# Altium schematic sheet Power_Amplifier.SchDoc
size A4; DocumentNumber: 11; SheetNumber: 11; SheetTotal: 11
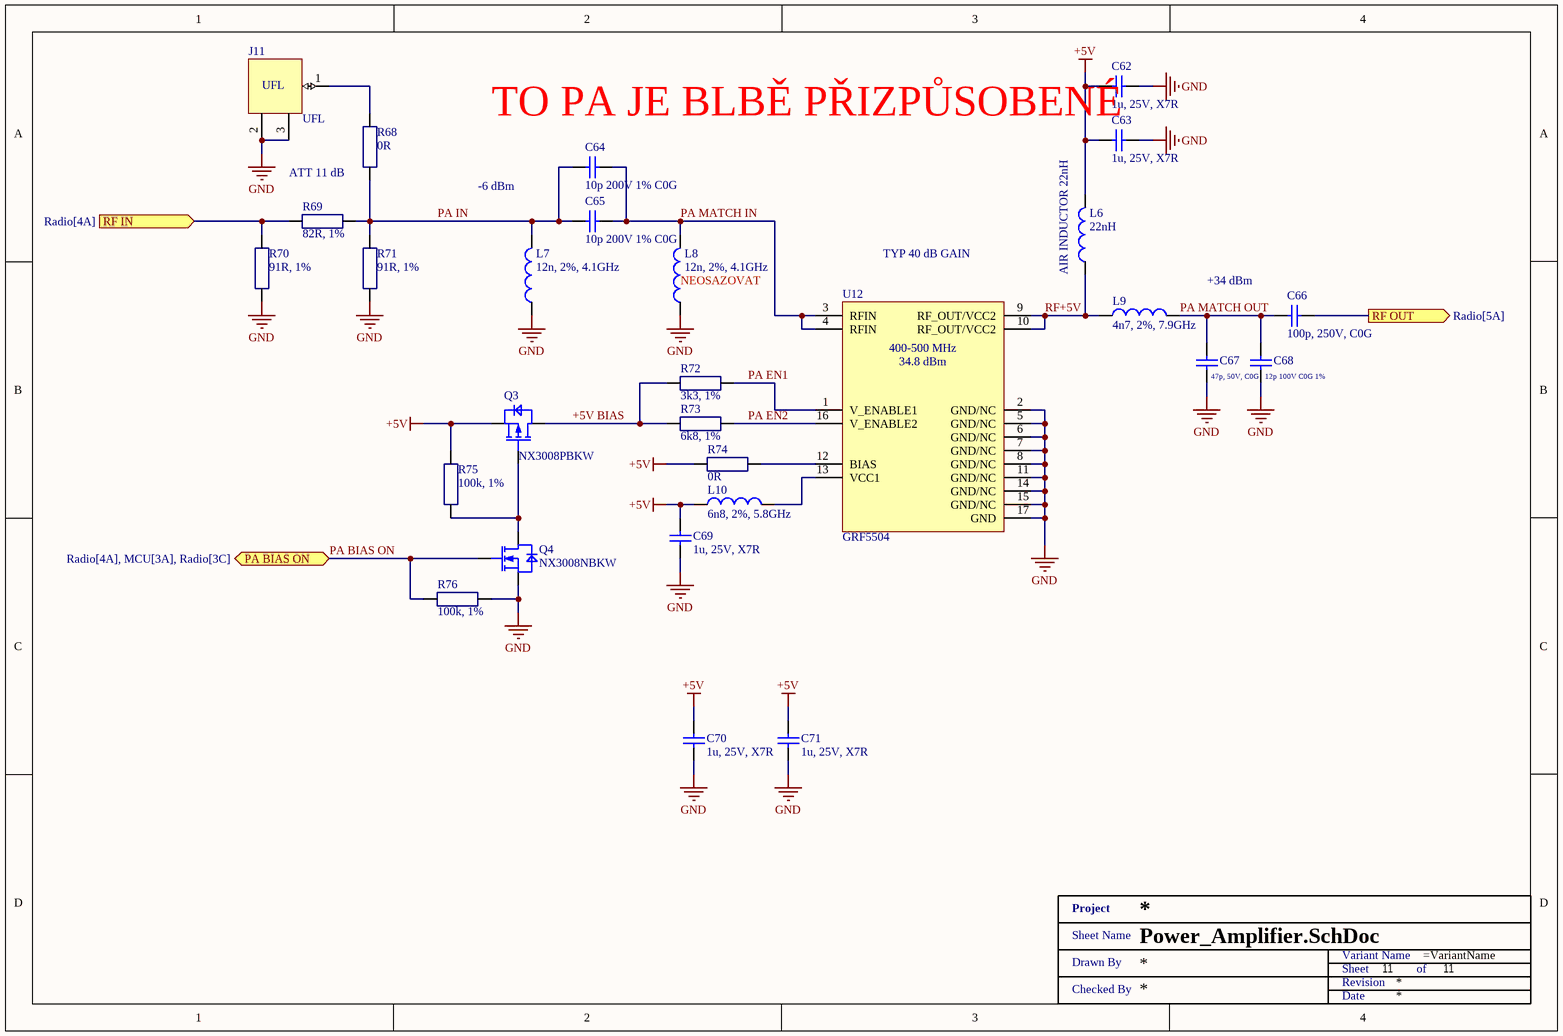
[diagram p0: Power_Amplifier.SchDoc]

## Parts
C62  1u, 25V, X7R  [SMD0603]
C63  1u, 25V, X7R  [SMD0603]
C64  10p 200V 1% C0G  [SMD0603]
C65  10p 200V 1% C0G  [SMD0603]
C66  100p, 250V, C0G  [SMD0603]
C67  47p, 50V, C0G  [SMD0603]
C68  12p 100V C0G 1%  [SMD0603]
C69  1u, 25V, X7R  [SMD0603]
C70  1u, 25V, X7R  [SMD0603]
C71  1u, 25V, X7R  [SMD0603]
J11  UFL  [CONUFL001-SMD-T]
L6  22nH  [Air-Inductor-25nH]
L7  12n, 2%, 4.1GHz  [SMD0603 - L]
L8  12n, 2%, 4.1GHz  [SMD0603 - L]
L9  4n7, 2%, 7.9GHz  [SMD0603 - L]
L10  6n8, 2%, 5.8GHz  [SMD0603 - L]
Q3  NX3008PBKW  [SOT323]
Q4  NX3008NBKW  [SOT323]
R68  0R  [SMD0603 - R]
R69  82R, 1%  [SMD0603 - R]
R70  91R, 1%  [SMD0603 - R]
R71  91R, 1%  [SMD0603 - R]
R72  3k3, 1%  [SMD0603 - R]
R73  6k8, 1%  [SMD0603 - R]
R74  0R  [SMD0603 - R]
R75  100k, 1%  [SMD0603 - R]
R76  100k, 1%  [SMD0603 - R]
U12  GRF5504  [QFN50P300X300X80_HS-17M - os]
XX?  Title 1  (value not drawn)  (graphical)

## Ports
PA BIAS ON (bidir, see Radio[4A], MCU[3A], Radio[3C]), RF IN (in, see Radio[4A]), RF OUT (out, see Radio[5A])

## Nets
+5V: C62.1 C63.1 C69.1 C70.1 C71.1 L6.2 L10.1 Q3.2(S) R74.1 R75.2
GND: C62.2 C63.2 C67.1 C68.1 C69.2 C70.2 C71.2 J11.2(GND) J11.3(GND) L7.1 L8.1 Q4.2(S) R70.1 R71.1 R76.1 U12.2(GND/NC) U12.5(GND/NC) U12.6(GND/NC) U12.7(GND/NC) U12.8(GND/NC) U12.11(GND/NC) U12.14(GND/NC) U12.15(GND/NC) U12.17(GND)
+5V BIAS: Q3.3(D) R72.1 R73.1
PA BIAS ON: Q4.1(G) R76.2 ; port PA BIAS ON
PA EN1: R72.2 U12.1(V_ENABLE1)
PA EN2: R73.2 U12.16(V_ENABLE2)
PA IN: C64.2 C65.2 L7.2 R68.1 R69.2 R71.2
PA MATCH IN: C64.1 C65.1 L8.2 U12.3(RFIN) U12.4(RFIN)
PA MATCH OUT: C66.1 C67.2 C68.2 L9.2
RF IN: R69.1 R70.2 ; port RF IN
RF OUT: C66.2 ; port RF OUT
RF+5V: L6.1 L9.1 U12.9(RF_OUT/VCC2) U12.10(RF_OUT/VCC2)
NetJ11_1: J11.1(S) R68.2
NetL10_2: L10.2 U12.13(VCC1)
NetQ3_1: Q3.1(G) Q4.3(D) R75.1
NetR74_2: R74.2 U12.12(BIAS)

## Notes on the sheet
- ATT 11 dB
- TO PA JE BLBĚ PŘIZPŮSOBENÉ
- -6 dBm
- (near L8) NEOSAZOVAT
- TYP 40 dB GAIN
- (near L6) AIR INDUCTOR 22nH
- +34 dBm
- (in symbol GRF5504) 400-500 MHz; 34.8 dBm
- (in symbol Title 1) Project; Sheet Name; Variant Name; Drawn By; Sheet; of; Revision; Checked By; Date

## Library data of the parts
C62 C63 C69-C71 = CGA3E1X7R1E105K080AC: CAP CER 1UF 25V X7R 0603; Manufacturer: TDK Corporation; Tolerance: ±10%; Manufacturer Part Number: CGA3E1X7R1E105K080AC; RoHS: RoHS Compliant; Category: Capacitors; Stock 1: 109509; Pricing 1: 1=0.2, 10=0.135, 100=0.0686, 500=0.04696, 1000=0.04154 (USD); Packaging: Cut Tape (CT); Part Status: Active; Voltage - Rated: 25V; Temperature Coefficient: X7R; Operating Temperature: -55°C ~ 125°C; Features: -; Ratings: AEC-Q200; Applications: Automotive; Failure Rate: -; Mounting Type: Surface Mount, MLCC; Package / Case: 0603 (1608 Metric); Size / Dimension: 0.063" L x 0.032" W (1.60mm x 0.80mm); Height - Seated (Max): -; Thickness (Max): 0.035" (0.90mm); Lead Spacing: -; Lead Style: -; ComponentLink1URL: https://product.tdk.com/info/en/catalog/datasheets/mlcc_automotive_general_en.pdf; ComponentLink1Description: https://product.tdk.com/info/en/catalog/datasheets/mlcc_automotive_general_en.pdf; Capacitance: 1u; Supplier 1: Mouser; Supplier Part Number 1: 810-CGA3E1X7R1E105K; Supplier 2: Farnell; Supplier Part Number 2: 2346962; Supplier 3: Digi-Key; Supplier Part Number 3: 445-6931-1-ND
C64 C65 = 06032U100FAT2A: Cap Ceramic 10pF 200V C0G 1% Pad SMD 0603 125°C Ultra Low ESR T/R; Manufacturer: Kyocera AVX; Supplier 1: Mouser; Supplier Part Number 1: 581-06032U100FAT2A; Manufacturer Part Number: 06032U100FAT2A; RoHS: Yes; Category: Ceramic Capacitors; Stock 1: 12241; Pricing 1: 1=0.33, 10=0.227, 50=0.227, 100=0.137, 1000=0.087, 10000=0.07 (USD); ComponentLink1URL: https://datasheet.ciiva.com/219/useries-219573.pdf?src-supplier=Digi-Key; ComponentLink1Description: https://datasheet.ciiva.com/219/useries-219573.pdf?src-supplier=Digi-Key; ComponentLink2URL: https://datasheet.ciiva.com/16209/useries-16209209.pdf?src-supplier=Future+Electronics; ComponentLink2Description: https://datasheet.ciiva.com/16209/useries-16209209.pdf?src-supplier=Future+Electronics; Supplier 2: Arrow Electronics; Supplier Part Number 2: 06032U100FAT2A; Supplier 3: Newark; Supplier Part Number 3: 96Y8278; Capacitance: 10p
C66 = 885342006003: CAP CER 100PF 250V C0G/NP0 0603; Manufacturer: Wurth Electronics Inc.; Tolerance: ±5%; Temperature Coefficient: C0G, NP0; Notification: Current market demand for these product types have resulted in fluctuating and extending lead times. Lead times may differ.; Supplier 1: Digi-Key; Supplier Part Number 1: 732-12167-1-ND; Manufacturer Part Number: 885342006003; RoHS: RoHS Compliant; Category: Capacitors; Stock 1: 43; Pricing 1: 1=0.1, 10=0.043, 100=0.0385, 500=0.03406 (USD); Packaging: Cut Tape (CT); Part Status: Active; Voltage - Rated: 250V; Operating Temperature: -55°C ~ 125°C; Features: -; Ratings: -; Applications: General Purpose; Failure Rate: -; Mounting Type: Surface Mount, MLCC; Package / Case: 0603 (1608 Metric); Size / Dimension: 0.063" L x 0.031" W (1.60mm x 0.80mm); Height - Seated (Max): -; Thickness (Max): 0.034" (0.87mm); Lead Spacing: -; Lead Style: -; ComponentLink1URL: https://katalog.we-online.de/pbs/datasheet/885342006003.pdf; ComponentLink1Description: https://katalog.we-online.de/pbs/datasheet/885342006003.pdf; Supplier 2: Farnell; Supplier Part Number 2: 2812519; Supplier 3: Mouser; Supplier Part Number 3: 710-885342006003; Capacitance: 100p
C67 = C0603C470J5GACAUTO: CAP CER 47PF 50V C0G/NP0 0603; Manufacturer: KEMET; Tolerance: ±5%; Temperature Coefficient: C0G, NP0; Manufacturer Part Number: C0603C470J5GACAUTO; RoHS: RoHS Compliant; Category: Capacitors; Stock 1: 21519; Pricing 1: 1=0.12, 10=0.088, 100=0.0391, 500=0.02792, 1000=0.02193 (USD); Packaging: Cut Tape (CT); Part Status: Active; Voltage - Rated: 50V; Operating Temperature: -55°C ~ 125°C; Features: -; Ratings: AEC-Q200; Applications: Automotive; Failure Rate: -; Mounting Type: Surface Mount, MLCC; Package / Case: 0603 (1608 Metric); Size / Dimension: 0.063" L x 0.032" W (1.60mm x 0.80mm); Height - Seated (Max): -; Thickness (Max): 0.034" (0.87mm); Lead Spacing: -; Lead Style: -; ComponentLink1URL: https://search.kemet.com/component-edge/download/datasheet/C0603C470J5GACAUTO.pdf; ComponentLink1Description: https://search.kemet.com/component-edge/download/datasheet/C0603C470J5GACAUTO.pdf; Capacitance: 47p; Supplier 1: Mouser; Supplier Part Number 1: 80-C0603C470J5G; Supplier 2: Farnell; Supplier Part Number 2: 1414639; Supplier 3: Digi-Key; Supplier Part Number 3: 399-6890-1-ND; Supplier 4: TME; Supplier Part Number 4: C0603C470J5GAC
C68 = 06031U120FAT2A: Cap Ceramic 12pF 100V C0G 1% SMD 0603 125°C T/R; Manufacturer: Kyocera AVX; Supplier 1: Mouser; Supplier Part Number 1: 581-06031U120FAT2A; Manufacturer Part Number: 06031U120FAT2A; RoHS: Yes; Category: Ceramic Capacitors; Stock 1: 6418; Pricing 1: 1=0.33, 10=0.227, 50=0.227, 100=0.137, 1000=0.087, 10000=0.07 (USD); Mounting Technology: Surface Mount; Case/Package: 0603; Case Code (Metric): 1608; Case Code (Imperial): 0603; Min Operating Temperature: -55°C; Max Operating Temperature: 125°C; Packaging: Tape and Reel; Capacitance: 12p; Tolerance: 1%; Package Quantity: 4000; Voltage Rating: 100V; Voltage Rating (DC): 100V; Dielectric: C0G; Termination: SMD/SMT; Series: U; Construction: Flat; Length: 1.6mm; Width: 0.81mm; Depth: 0.76mm; Radiation Hardening: No; RoHS Compliant: Yes; ComponentLink1URL: https://datasheet.ciiva.com/208/useries-208490.pdf?src-supplier=Digi-Key; ComponentLink1Description: https://datasheet.ciiva.com/208/useries-208490.pdf?src-supplier=Digi-Key
J11 = CONUFL001-SMD-T: CONN UMC JACK STR SMD; Manufacturer: Linx Technologies Inc.; Connector Style: Ultra Miniature Coaxial; Connector Type: Jack, Male Pin; Supplier 1: Digi-Key; Supplier Part Number 1: CONUFL001-SMD-TCT-ND; Manufacturer Part Number: CONUFL001-SMD-T; RoHS: RoHS Compliant; Category: Connectors, Interconnects; Stock 1: 6423; Pricing 1: 1=0.97, 25=0.882, 100=0.826, 1000=0.742, 2500=0.63 (USD); Packaging: Cut Tape (CT); Part Status: Active; Contact Termination: -; Shield Termination: -; Impedance: -; Mounting Type: Surface Mount; Mounting Feature: -; Cable Group: -; Fastening Type: Snap-On; Features: -; Housing Color: -; Ingress Protection: -; Includes: -; Body Material: -; Body Finish: -; Center Contact Plating: -; Dielectric Material: -; Operating Temperature: -; Center Contact Material: -; Mating Cycles: -; Insertion Loss: -; ComponentLink1URL: http://media.digikey.com/pdf/Data%20Sheets/Linx%20Technologies%20PDFs/CONUFL001-SMD_T_Dwg_RevB_5-15-17.pdf; ComponentLink1Description: http://media.digikey.com/pdf/Data%20Sheets/Linx%20Technologies%20PDFs/CONUFL001-SMD_T_Dwg_RevB_5-15-17.pdf; Supplier 2: Mouser; Supplier Part Number 2: 712-CONUFL001-SMD-T
L6 = Air-Inductor_20nH
L7 L8 = 0603HP-12NXGLU: Fixed Inductors 0603HP Hi Perfrmnce 12 nH 2 % 1.1 A; Manufacturer: Coilcraft; Core Material: Ceramic; Q Factor: 91; Max DC Current: 1.1A; DC Resistance (DCR): 88mR; Test Frequency: 250MHz; Supplier 1: Mouser; Supplier Part Number 1: 994-0603HP-12NXGLU; Manufacturer Part Number: 0603HP-12NXGLU; Stock 1: 1052; Pricing 1: 1=1.18000, 10=1.18000, 50=1.18000, 100=1.18000, 200=0.89000, 500=0.66000, 1000=0.44000, 2000=0.40500 (USD); RoHS: Yes; Mount: Surface Mount; Case/Package: 0603; Case Code (Metric): 1608; Case Code (Imperial): 0603; Min Operating Temperature: -40°C; Max Operating Temperature: 125°C; Packaging: Cut Tape; Tolerance: 2%; Inductance: 12n; Self Resonant Frequency: 4.1GHz; Termination: SMD/SMT; Inductance Tolerance: 2%; Current Rating: 1.1A; Length: 1.75mm; Height: 0.94mm; Width: 1.09mm; Lead Free: Contains Lead; REACH SVHC: No SVHC; ComponentLink1URL: https://datasheet.ciiva.com/13167/0603hp-13167775.pdf?src-supplier=Mouser; ComponentLink1Description: https://datasheet.ciiva.com/13167/0603hp-13167775.pdf?src-supplier=Mouser; ComponentLink2URL: https://datasheet.ciiva.com/22680/1681881-22680847.pdf?src-supplier=Element14; ComponentLink2Description: https://datasheet.ciiva.com/22680/1681881-22680847.pdf?src-supplier=Element14; Supplier 2: Farnell; Supplier Part Number 2: 2286146
L9 = 0603HP-4N7XGLU: Fixed Inductors 0603HP Hi Perfrmnce 4.7 nH 2 % 1.1 A; Manufacturer: Coilcraft; Core Material: Ceramic; Q Factor: 75; Max DC Current: 1.1A; DC Resistance (DCR): 100mR; Test Frequency: 250MHz; Supplier 1: Mouser; Supplier Part Number 1: 994-0603HP-4N7XGLU; Manufacturer Part Number: 0603HP-4N7XGLU; Stock 1: 884; Pricing 1: 1=1.50000, 10=1.40000, 50=1.22000, 100=1.12000, 200=1.06000, 500=0.74800, 1000=0.47800, 2000=0.40500 (USD); RoHS: Yes; Mount: Surface Mount; Case/Package: 0603; Case Code (Metric): 1608; Case Code (Imperial): 0603; Min Operating Temperature: -40°C; Max Operating Temperature: 125°C; Packaging: Cut Tape; Tolerance: 2%; Inductance: 4n7; Self Resonant Frequency: 7.9GHz; Termination: SMD/SMT; Inductance Tolerance: 2%; Current Rating: 1.1A; Length: 1.75mm; Height: 0.94mm; Width: 1.09mm; Lead Free: Contains Lead; REACH SVHC: No SVHC; ComponentLink1URL: https://datasheet.ciiva.com/22680/1681881-22680887.pdf?src-supplier=Element14; ComponentLink1Description: https://datasheet.ciiva.com/22680/1681881-22680887.pdf?src-supplier=Element14; Supplier 2: Farnell; Supplier Part Number 2: 2286132
L10 = 0603HP-6N8XGLU: Fixed Inductors RF Chip Inductor 6.8 nH 2 % 1.4 A; Manufacturer: Coilcraft; Core Material: Ceramic; Q Factor: 143; Max DC Current: 1.4A; DC Resistance (DCR): 42mR; Test Frequency: 250MHz; Supplier 1: Mouser; Supplier Part Number 1: 994-0603HP-6N8XGLU; Manufacturer Part Number: 0603HP-6N8XGLU; Stock 1: 1868; Pricing 1: 1=1.18000, 10=1.18000, 50=1.18000, 100=1.18000, 200=0.89000, 500=0.66000, 1000=0.44000, 2000=0.40500 (USD); RoHS: Yes; Mount: Surface Mount; Case/Package: 0603; Case Code (Imperial): 0603; Case Code (Metric): 1608; Min Operating Temperature: -40°C; Max Operating Temperature: 125°C; Packaging: Cut Tape; Tolerance: 2%; Inductance: 6n8; Self Resonant Frequency: 5.8GHz; Termination: SMD/SMT; Inductance Tolerance: 2%; Current Rating: 1.4A; Length: 1.75mm; Height: 0.94mm; Width: 1.09mm; Lead Free: Contains Lead; REACH SVHC: No SVHC; ComponentLink1URL: https://datasheet.ciiva.com/22680/1681881-22680901.pdf?src-supplier=Element14; ComponentLink1Description: https://datasheet.ciiva.com/22680/1681881-22680901.pdf?src-supplier=Element14; ComponentLink2URL: https://datasheet.ciiva.com/13143/0603hp-13143195.pdf?src-supplier=Mouser; ComponentLink2Description: https://datasheet.ciiva.com/13143/0603hp-13143195.pdf?src-supplier=Mouser; ComponentLink3URL: https://datasheet.ciiva.com/22709/1681881-22709629.pdf?src-supplier=Element14; ComponentLink3Description: https://datasheet.ciiva.com/22709/1681881-22709629.pdf?src-supplier=Element14; Supplier 2: Farnell; Supplier Part Number 2: 2286136
Q3 = NX3008PBKW: NXP - NX3008PBKW - MOSFET, P CH, 30V, 200MA, SOT323; Transistor Polarity: P Channel; Continuous Drain Current Id: -200; Drain Source Voltage Vds: -30; On Resistance Rds(on): 2.8; Rds(on) Test Voltage Vgs: -4.5; Threshold Voltage Vgs: -900; Power Dissipation Pd: 260; Transistor Case Style: SOT-323; No. of Pins: 3; SVHC: No SVHC (17-Dec-2015); Pulse Current Idm: -0.8; Voltage Vgs th Max: 8V<!--FANDB--><div class="features-and-benefits-container"><div class="features-and-benefits-description"><span class="features-benefits-value">The NX3008PBKW is a P-channel enhancement mode Field-Effect Transistor (FET) in surface mount plastic package using Trench MOSFET technology. Suitable for relay driver, high-speed line driver and high-side loadswitch.</span></div><div class="features-and-benefits-list"><ul class="features-and-benefits-list-list"><li class="features-and-benefits-list-item">Logic-level compatible</li><li class="features-and-benefits-list-item">Very fast switching</li><li class="features-and-benefits-list-item">AEC-Q101 Qualified</li><li class="features-and-benefits-list-item">Up to 1; Supplier 1: Farnell; Supplier Part Number 1: 2069551; Manufacturer: NXP; Manufacturer Part Number: NX3008PBKW; RoHS: YES; Stock 1: 18626; Pricing 1: 1=0.037, 25=0.0347, 100=0.0323, 250=0.03, 500=0.0294, 2000=0.0288, 4000=0.0282, 20000=0.0276 (GBP); Operating Temperature Max: 150; Product Range: -; Automotive Qualification Standard: -; MSL: MSL 1 - Unlimited; Operating Temperature Min: -55; Operating Temperature Range: -55°C to +150; ComponentLink1URL: http://www.farnell.com/datasheets/1508398.pdf; ComponentLink1Description: http://www.farnell.com/datasheets/1508398.pdf; Supplier 2: Digi-Key; Supplier Part Number 2: 568-10503-1-ND
Q4 = NX3008NBKW: NXP - NX3008NBKW - MOSFET, N CH, 30V, 350MA, SOT323; Transistor Polarity: N Channel; Continuous Drain Current Id: 350; Drain Source Voltage Vds: 30; On Resistance Rds(on): 1; Rds(on) Test Voltage Vgs: 4.5; Threshold Voltage Vgs: 900; Power Dissipation Pd: 260; Transistor Case Style: SOT-323; No. of Pins: 3; SVHC: No SVHC (17-Dec-2015); Pulse Current Idm: -0.8; Voltage Vgs th Max: 8; Manufacturer: NXP; Manufacturer Part Number: NX3008NBKW; RoHS: YES; Stock 1: 4764; Pricing 1: 1=0.0425, 25=0.0385, 100=0.0347, 250=0.0334, 500=0.0312, 2000=0.0291, 4000=0.0282, 20000=0.0273 (GBP); Operating Temperature Max: 150; Product Range: -; Automotive Qualification Standard: -; MSL: MSL 1 - Unlimited; Operating Temperature Min: -55; Operating Temperature Range: -55°C to +150; ComponentLink1URL: http://www.farnell.com/datasheets/1508392.pdf; ComponentLink1Description: http://www.farnell.com/datasheets/1508392.pdf; Supplier 1: Mouser; Supplier Part Number 1: 771-NX3008NBKW,115; Supplier 2: Farnell; Supplier Part Number 2: 2069546; Supplier 3: Arrow; Supplier Part Number 3: NX3008NBKW,115
R68 R74 = CRCW06030000Z0EA: RES SMD 0 OHM JUMPER 1/10W 0603; Manufacturer: Vishay Dale; Power (Watts): 0.1W, 1/10W; Manufacturer Part Number: CRCW06030000Z0EA; RoHS: RoHS Compliant; Category: Resistors; Stock 1: 0; Pricing 1: 1=0.1, 10=0.028, 25=0.0204, 50=0.0154, 100=0.0114, 250=0.00868, 500=0.00694, 1000=0.00511 (USD); Packaging: Cut Tape (CT); Part Status: Active; Tolerance: Jumper; Composition: Thick Film; Features: Automotive AEC-Q200; Temperature Coefficient: -; Operating Temperature: -55°C ~ 155°C; Package / Case: 0603 (1608 Metric); Supplier Device Package: 0603; Size / Dimension: 0.063" L x 0.033" W (1.60mm x 0.85mm); Height - Seated (Max): 0.020" (0.50mm); Failure Rate: -; ComponentLink1URL: http://www.vishay.com/docs/20035/dcrcwe3.pdf; ComponentLink1Description: http://www.vishay.com/docs/20035/dcrcwe3.pdf; Resistance: 0R; Supplier 1: Mouser; Supplier Part Number 1: 71-CRCW0603-0-E3; Supplier 2: Farnell; Supplier Part Number 2: 1469739; Supplier 3: Digi-Key; Supplier Part Number 3: 541-0.0GCT-ND
R69 = WR06X82R0FTL: WALSIN - WR06X82R0FTL - RESISTOR, THICK FILM, 82R, 1%, 75V, 0603; Voltage Rating: 75; Resistor Case Style: 0603 [1608 Metric]; Power Rating: 100; Product Range: WR06 Series; Temperature Coefficient: ± 100; Supplier 1: Farnell; Supplier Part Number 1: 2502484; Manufacturer: WALSIN; Manufacturer Part Number: WR06X82R0FTL; RoHS: YES; Stock 1: 1700; Pricing 1: 10=0.0128, 100=0.0043, 500=0.0026, 1000=0.0018, 2500=0.0014 (GBP); Resistance: 82R; Resistance Tolerance: ± 1%; Packaging: Cut Tape; Resistor Element Material: Thick Film; Automotive Qualification Standard: -; MSL: MSL 2 - 1 year<!--FANDB--><div class="features-and-benefits-container"><div class="features-and-benefits-desc-container"><span class="features-and-benefits-container-desc">SMD Chip Resistor, 82 ohm, 75 V, 0603 [1608 Metric], 100 mW, ± 1%, WR06 Series</span></div><div class="features-and-benefits-description"><span class="features-benefits-value">The WR06 series resistors from Walsin are general purpose thick film chip resistors. These resistors are constructed in a high grade ceramic body (aluminium oxide).</span></div><div class="features-and-benefits-list"><ul class="features-and-benefits-list-list"><li class="features-and-benefits-list-item">Resistance range includes E24 and E96 decade values from 1ohm to 10Mohm</li><li class="features-and-benefits-list-item">EIA 0603 case size</li><li class="features-and-benefits-list-item">Available in ?±100ppm/°C and -200ppm/°C to +400ppm/°C TCR values</li><li class="features-and-benefits-list-item">Available in ±1% and ±5% tolerance</li><li class="features-and-benefits-list-item">High reliability and stability</li><li class="features-and-benefits-list-item">Higher component and equipment reliability</li><li class="features-and-benefits-list-item">Lower assembly costs</li><li class="features-and-benefits-list-item">Reduced size of final equipment</li><li class="features-and-benefits-list-item">Continuous working voltage is 75V and rated power is 100; ComponentLink1URL: http://www.farnell.com/datasheets/1960319.pdf; ComponentLink1Description: http://www.farnell.com/datasheets/1960319.pdf
R70 R71 = RC0603FR-0791RL: SMD Chip Resistor, 91 Ohm, ± 1%, 100 mW, 0603 [1608 Metric], Thick Film, General Purpose; Manufacturer: Yageo; Power Rating: 100mW; Voltage Rating: 50V; Temperature Coefficient: 100ppm/°C; Supplier 1: Mouser; Supplier Part Number 1: 603-RC0603FR-0791RL; Manufacturer Part Number: RC0603FR-0791RL; RoHS: Yes; Category: Chip SMD Resistors; Stock 1: 58719; Pricing 1: 1=0.1, 10=0.011, 50=0.011, 100=0.006, 1000=0.004, 10000=0.004 (USD); Case/Package: 0603; Case Code (Imperial): 0603; Case Code (Metric): 1608; Min Operating Temperature: -55°C; Max Operating Temperature: 155°C; Packaging: Tape and Reel; Resistance: 91R; Tolerance: 1%; Termination: SMD/SMT; Number of Terminations: 2; Max Power Dissipation: 100mW; Features: Moisture Resistant; Series: RC; Construction: Rectangular; Voltage Rating (DC): 50V; Length: 1.6mm; Width: 0.8mm; Height: 0.45mm; Depth: 0.8mm; Military Standard: Not; RoHS Compliant: Yes; Lead Free: 5697LeadFree; ComponentLink1URL: https://datasheet.ciiva.com/2455/pyu-r-int-thick-7-2455336.pdf?src-supplier=Digi-Key; ComponentLink1Description: https://datasheet.ciiva.com/2455/pyu-r-int-thick-7-2455336.pdf?src-supplier=Digi-Key; ComponentLink2URL: https://datasheet.ciiva.com/2455/pyu-r-int-thick-7-2455337.pdf?src-supplier=Digi-Key; ComponentLink2Description: https://datasheet.ciiva.com/2455/pyu-r-int-thick-7-2455337.pdf?src-supplier=Digi-Key; ComponentLink3URL: https://datasheet.ciiva.com/2455/pyu-r-int-thick-7-2455335.pdf?src-supplier=Digi-Key; ComponentLink3Description: https://datasheet.ciiva.com/2455/pyu-r-int-thick-7-2455335.pdf?src-supplier=Digi-Key; Supplier 2: Farnell; Supplier Part Number 2: 3950881; Supplier 3: Digi-Key; Supplier Part Number 3: 311-91.0HRCT-ND
R72 = RC0603FR-073K3L: YAGEO - RC0603FR-073K3L - SMD Chip Resistor, 0603 [1608 Metric], 3.3 kohm, RC Series, 75 V, Thick Film, 100 mW; Voltage Rating (DC): 50V; Temperature Coefficient: 100ppm/°C; Power Rating: 100mW; Supplier 1: Mouser; Supplier Part Number 1: 603-RC0603FR-073K3L; Manufacturer: Yageo; Manufacturer Part Number: RC0603FR-073K3L; RoHS: Yes; Category: Chip SMD Resistors; Stock 1: 695285; Pricing 1: 1=0,10000, 10=0,01800, 100=0,00600, 1000=0,00500, 5000=0,00300, 10000=0,00300 (USD); Case/Package: 0603; Number of Pins: 2; Case Code (Imperial): 0603; Case Code (Metric): 1608; Min Operating Temperature: -55°C; Max Operating Temperature: 155°C; Resistance: 3k3; Tolerance: 1%; Packaging: Tape and Reel; Composition: Thick Film; Voltage Rating: 50V; Package Quantity: 1; Termination: SMD/SMT; Number of Terminations: 2; Military Standard: Not; Max Power Dissipation: 100mW; Features: Moisture Resistant; Length: 1.6mm; Height: 0.45mm; Width: 0.8mm; Depth: 0.8mm; REACH SVHC: No SVHC; Lead Free: Lead Free; ComponentLink1URL: https://datasheet.ciiva.com/2453/pyu-r-int-thick-7-2453926.pdf?src-supplier=Digi-Key; ComponentLink1Description: https://datasheet.ciiva.com/2453/pyu-r-int-thick-7-2453926.pdf?src-supplier=Digi-Key; ComponentLink2URL: https://datasheet.ciiva.com/2453/pyu-r-int-thick-7-2453927.pdf?src-supplier=Digi-Key; ComponentLink2Description: https://datasheet.ciiva.com/2453/pyu-r-int-thick-7-2453927.pdf?src-supplier=Digi-Key; ComponentLink3URL: https://datasheet.ciiva.com/7746/443971-7746344.pdf?src-supplier=Element14; ComponentLink3Description: https://datasheet.ciiva.com/7746/443971-7746344.pdf?src-supplier=Element14; ComponentLink4URL: https://datasheet.ciiva.com/7746/1686128-7746345.pdf?src-supplier=Element14; ComponentLink4Description: https://datasheet.ciiva.com/7746/1686128-7746345.pdf?src-supplier=Element14; ComponentLink5URL: https://datasheet.ciiva.com/46440/1868787-46440905.pdf?src-supplier=Element14; ComponentLink5Description: https://datasheet.ciiva.com/46440/1868787-46440905.pdf?src-supplier=Element14; ComponentLink6URL: https://datasheet.ciiva.com/7746/443971-7746346.pdf?src-supplier=Element14; ComponentLink6Description: https://datasheet.ciiva.com/7746/443971-7746346.pdf?src-supplier=Element14; Supplier 2: Farnell; Supplier Part Number 2: 2421870; Supplier 3: Digi-Key; Supplier Part Number 3: 311-3.30KHRCT-ND
R73 = RC0603FR-076K8L: Res Thick Film 0603 6.8K Ohm 1% 0.1W(1/10W) ±100ppm/C Pad SMD T/R; Manufacturer: Yageo; Voltage Rating (DC): 50V; Power Rating: 100mW; Temperature Coefficient: 100ppm/°C; Supplier 1: Mouser; Supplier Part Number 1: 603-RC0603FR-076K8L; Manufacturer Part Number: RC0603FR-076K8L; RoHS: Yes; Category: Chip SMD Resistors; Stock 1: 241804; Pricing 1: 1=0,10000, 10=0,01800, 100=0,00600, 1000=0,00500, 5000=0,00300, 10000=0,00300 (USD); Case/Package: 0603; Number of Pins: 2; Case Code (Imperial): 0603; Case Code (Metric): 1608; Min Operating Temperature: -55°C; Max Operating Temperature: 155°C; Packaging: Tape and Reel; Resistance: 6k8; Tolerance: 1%; Voltage Rating: 50V; Package Quantity: 1; Termination: SMD/SMT; Composition: Thick Film; Number of Terminations: 2; Military Standard: Not; Max Power Dissipation: 100mW; Features: Moisture Resistant; Length: 0.063inch; Height: 0.022inch; Width: 0.031inch; Depth: 0.8mm; REACH SVHC: No SVHC; Lead Free: Lead Free; ComponentLink1URL: https://datasheet.ciiva.com/46412/443971-46412856.pdf?src-supplier=Element14; ComponentLink1Description: https://datasheet.ciiva.com/46412/443971-46412856.pdf?src-supplier=Element14; ComponentLink2URL: https://datasheet.ciiva.com/7746/443971-7746394.pdf?src-supplier=Element14; ComponentLink2Description: https://datasheet.ciiva.com/7746/443971-7746394.pdf?src-supplier=Element14; ComponentLink3URL: https://datasheet.ciiva.com/7746/443971-7746395.pdf?src-supplier=Element14; ComponentLink3Description: https://datasheet.ciiva.com/7746/443971-7746395.pdf?src-supplier=Element14; ComponentLink4URL: https://datasheet.ciiva.com/2454/pyu-r-int-thick-7-2454156.pdf?src-supplier=Digi-Key; ComponentLink4Description: https://datasheet.ciiva.com/2454/pyu-r-int-thick-7-2454156.pdf?src-supplier=Digi-Key; ComponentLink5URL: https://datasheet.ciiva.com/2454/pyu-r-int-thick-7-2454157.pdf?src-supplier=Digi-Key; ComponentLink5Description: https://datasheet.ciiva.com/2454/pyu-r-int-thick-7-2454157.pdf?src-supplier=Digi-Key; ComponentLink6URL: https://datasheet.ciiva.com/2454/pyu-r-int-thick-7-2454158.pdf?src-supplier=Digi-Key; ComponentLink6Description: https://datasheet.ciiva.com/2454/pyu-r-int-thick-7-2454158.pdf?src-supplier=Digi-Key; ComponentLink7URL: https://datasheet.ciiva.com/7983/443971-7983662.pdf?src-supplier=Element14; ComponentLink7Description: https://datasheet.ciiva.com/7983/443971-7983662.pdf?src-supplier=Element14; ComponentLink8URL: https://datasheet.ciiva.com/46371/1868787-46371519.pdf?src-supplier=Element14; ComponentLink8Description: https://datasheet.ciiva.com/46371/1868787-46371519.pdf?src-supplier=Element14; Supplier 2: Farnell; Supplier Part Number 2: 2421883; Supplier 3: Digi-Key; Supplier Part Number 3: 311-6.80KHRCT-ND
R75 R76 = RC0603FR-07100KL: RES SMD 100K OHM 1% 1/10W 0603; Manufacturer: Yageo; Power (Watts): 0.1W, 1/10W; Temperature Coefficient: ±100ppm/°C; Manufacturer Part Number: RC0603FR-07100KL; RoHS: RoHS Compliant; Category: Resistors; Stock 1: 14618646; Pricing 1: 1=0.1, 10=0.015, 100=0.006, 1000=0.00268, 2500=0.00233 (USD); Packaging: Cut Tape (CT); Part Status: Active; Tolerance: ±1%; Composition: Thick Film; Features: Moisture Resistant; Operating Temperature: -55°C ~ 155°C; Package / Case: 0603 (1608 Metric); Supplier Device Package: 0603; Size / Dimension: 0.063" L x 0.032" W (1.60mm x 0.80mm); Height - Seated (Max): 0.022" (0.55mm); Failure Rate: -; ComponentLink1URL: http://www.yageo.com/documents/recent/PYu-RC_Group_51_RoHS_L_8.pdf; ComponentLink1Description: http://www.yageo.com/documents/recent/PYu-RC_Group_51_RoHS_L_8.pdf; Resistance: 100k; Supplier 1: Mouser; Supplier Part Number 1: 603-RC0603FR-07100KL; Supplier 2: Farnell; Supplier Part Number 2: 9238727; Supplier 3: Digi-Key; Supplier Part Number 3: 311-100KHRCT-ND
U12 = GRF5504: Amplifier, Power, 0.4–0.5 GHz, 41.0 dB, 34.8 dBm, 3.0 x 3.0 mm QFN-16; Manufacturer: Guerrilla RF; Supplier 1: Mouser; Supplier Part Number 1: 459-GRF5504; Manufacturer Part Number: GRF5504; RoHS: No; Category: LDO; Stock 1: 6789; Pricing 1: 1=6.08, 10=5.78, 50=5.78, 100=5.33, 1000=2.39, 10000=2.03 (USD); Supplier 2: Richardson RFPD; Supplier Part Number 2: GRF5504